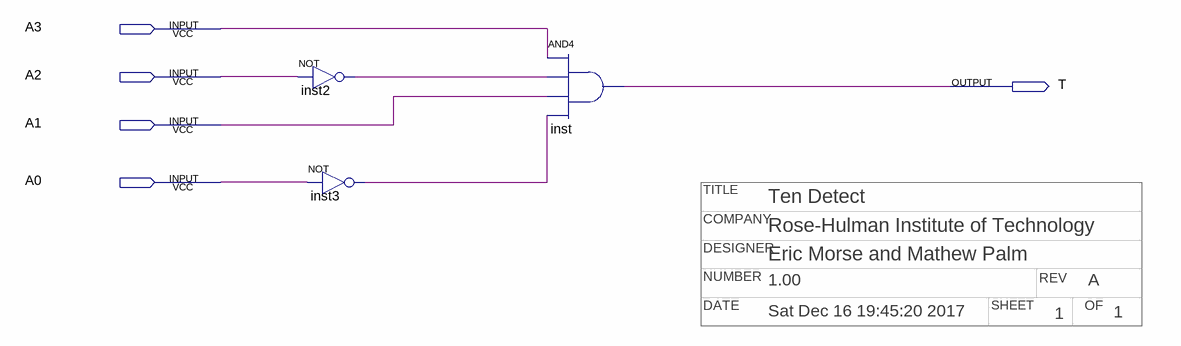
[diagram p0: schematic sheet]
// Quartus schematic ten_detect.bdf as structural Verilog: 3 symbols, 5 pins
// Title block: COMPANY: Rose-Hulman Institute of Technology; DATE: Sat Dec 16 19:45:20 2017; DESIGNER: Eric Morse and Mathew Palm; NUMBER: 1.00; OF: 1; REV: A; SHEET: 1; TITLE: Ten Detect
module ten_detect (
  input  A3,
  input  A2,
  input  A1,
  input  A0,
  output T
);

  wire inst2_out, inst3_out;

  not inst2 (inst2_out, A2);
  not inst3 (inst3_out, A0);
  and inst (T, A3, inst2_out, A1, inst3_out);
endmodule
